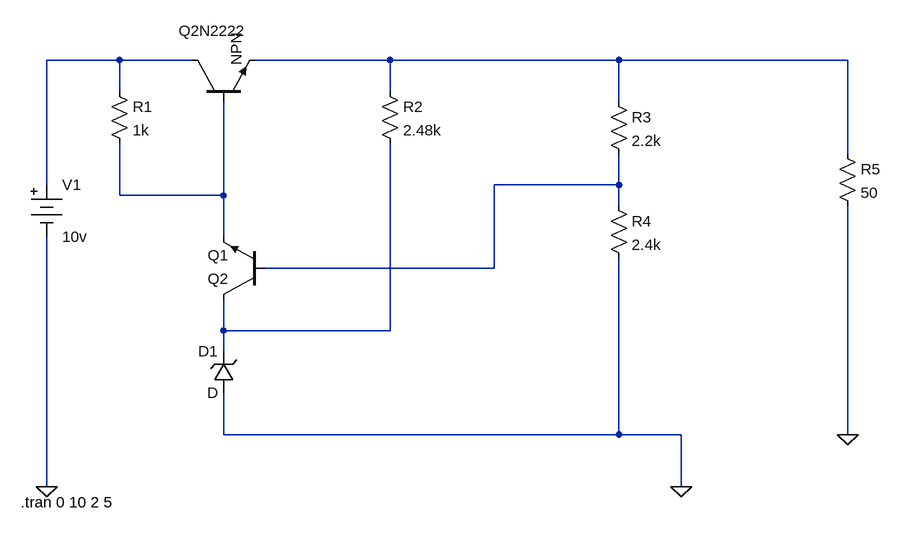
[diagram p0: schematic Draft1.asc]
Draft1.asc, the LTspice schematic file:
Version 4.1
SHEET 1 1352 696
WIRE 176 0 64 0
WIRE 288 0 176 0
WIRE 592 0 384 0
WIRE 944 0 592 0
WIRE 1296 0 944 0
WIRE 176 48 176 0
WIRE 592 48 592 0
WIRE 944 64 944 0
WIRE 1296 144 1296 0
WIRE 64 192 64 0
WIRE 944 192 944 144
WIRE 944 192 752 192
WIRE 176 208 176 128
WIRE 336 208 336 64
WIRE 336 208 176 208
WIRE 944 224 944 192
WIRE 336 272 336 208
WIRE 752 320 752 192
WIRE 752 320 400 320
WIRE 336 416 336 368
WIRE 592 416 592 128
WIRE 592 416 336 416
WIRE 336 448 336 416
WIRE 336 576 336 512
WIRE 944 576 944 304
WIRE 944 576 336 576
WIRE 1040 576 944 576
WIRE 1296 576 1296 224
WIRE 64 656 64 272
WIRE 1040 656 1040 576
FLAG 1296 576 0
FLAG 1040 656 0
FLAG 64 656 0
SYMBOL res 160 32 R0
SYMATTR InstName R1
SYMATTR Value 1k
SYMBOL res 576 32 R0
SYMATTR InstName R2
SYMATTR Value 2.48k
SYMBOL res 928 48 R0
SYMATTR InstName R3
SYMATTR Value 2.2k
SYMBOL res 928 208 R0
SYMATTR InstName R4
SYMATTR Value 2.4k
SYMBOL res 1280 128 R0
SYMATTR InstName R5
SYMATTR Value 50
SYMBOL npn 288 64 R270
WINDOW 0 109 -21 VRight 2
SYMATTR InstName Q2N2222
SYMBOL Misc\\battery 64 176 R0
WINDOW 123 0 0 Left 0
WINDOW 39 0 0 Left 0
SYMATTR InstName V1
SYMATTR Value 10v
SYMBOL npn 400 368 R180
SYMATTR InstName Q2
SYMATTR Value Q1
SYMBOL zener 352 512 R180
WINDOW 0 24 64 Left 2
WINDOW 3 24 0 Left 2
SYMATTR InstName D1
TEXT 24 680 Left 2 !.tran 0 10 2 5

The netlist it stands for:
* Draft1.asc
R1 N001 N004 1k
R2 N002 N005 2.48k
R3 N002 N003 2.2k
R4 N003 0 2.4k
R5 N002 0 50
Q2N2222 N001 N004 N002 0 NPN
V1 N001 0 10v
Q2 N005 N003 N004 0 Q1
D1 0 N005 D
.model D D
.lib standard.dio
.model NPN NPN
.model PNP PNP
.lib standard.bjt
.tran 0 10 2 5
.backanno
.end